# Altium schematic sheet Top.SchDoc: IGN-101
size A4; Revision: V1.1; SheetNumber: 1; SheetTotal: 1
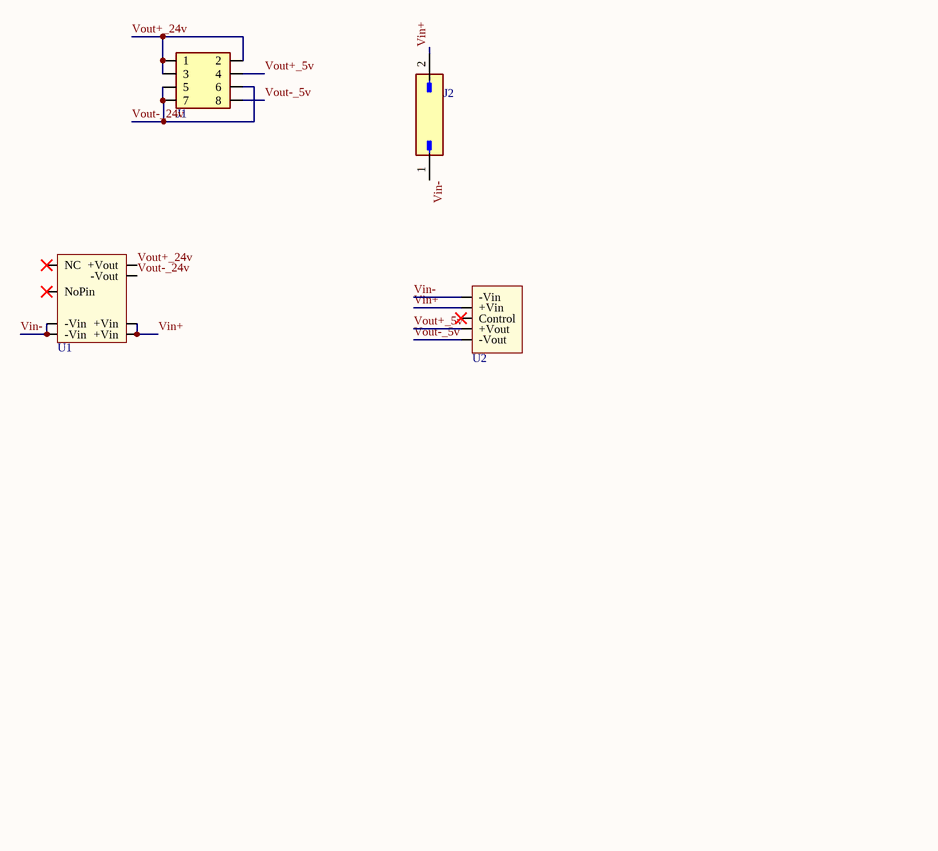
[diagram p0: Top.SchDoc]

## Parts
J1  430450800  [MOLEX_430450800]  (value not drawn)
J2  436500200  [MOLEX_436500200]  (value not drawn)
U1  DJ06S2424A  [DJ06S2424A]  (value not drawn)
U2  NCS1S2405SC  [CONV_NCS1S1203SC]  (value not drawn)

## Nets
Vin+: J2.2 U1.22(+Vin) U1.23(+Vin) U2.2(+Vin)
Vin-: J2.1 U1.2(-Vin) U1.3(-Vin) U2.1(-Vin)
Vout+_5v: J1.4 U2.6(+Vout)
Vout+_24v: J1.1 J1.2 J1.3 U1.14(+Vout)
Vout-_5v: J1.8 U2.7(-Vout)
Vout-_24v: J1.5 J1.6 J1.7 U1.16(-Vout)

Not connected (* = marked no-connect by the designer): U1 9(NoPin)* 11(NC)*; U2 3(Control)*

## Library data of the parts
J1 = 430450800: Conn 8 Position Throught Hole Dual Row ,Right Angle; MF: TE Connectivity; MP: 3-794637-8; Value: *; SnapEDA_Link: https://www.snapeda.com/parts/3-794637-8/TE%20Connectivity%20AMP%20Connectors/view-part/2381525/?ref=snap; Availability: Unavailable; Price: None; TE_purchase_URL: https://www.te.com/usa-en/product-3-794637-8.html?te_bu=Cor&te_type=disp&te_campaign=seda_glo_cor-seda-global-disp-prtnr-fy19-seda-model-bom-cta_sma-317_1&elqCampaignId=32493; Package: None; EU_RoHS_Compliance: Compliant
J2 = 436500200: Connector Molex 2 Pins Right Angle; Package: None; Value: *; Price: None; MP: 436500200; Availability: Unavailable
U1 = DJ06S2424A: Convertidores CC/CC aislados (orificio pasante) DC/DC Converter, 24Vout, 6W
U2 = NCS1S2405SC: Convertidores CC/CC aislados (orificio pasante) 1W 24VIN 5VOUT DC/DC